# Altium schematic sheet RMII_Ethernet.SchDoc: Stabilizer
size 420 x 297 mm; Author: G.Kasprowicz; CompanyName: WUT ISE; DrawnBy: G.Kasprowicz; Organization: WUT ISE; Address1: PW ISE; Address2: Nowowiejska 15/19 00-665 Warsaw; Address3: gkasprow@gmail.com; DocumentNumber: 4; Revision: 3.4; SheetNumber: 4; SheetTotal: 11; ModifiedBy: -; CheckedDate: -; Title2: Ethernet; DivGrp: WUT ISE; Designer: G.Kasprowicz; ModifiedDate: -; ProjectName: Sensor Box
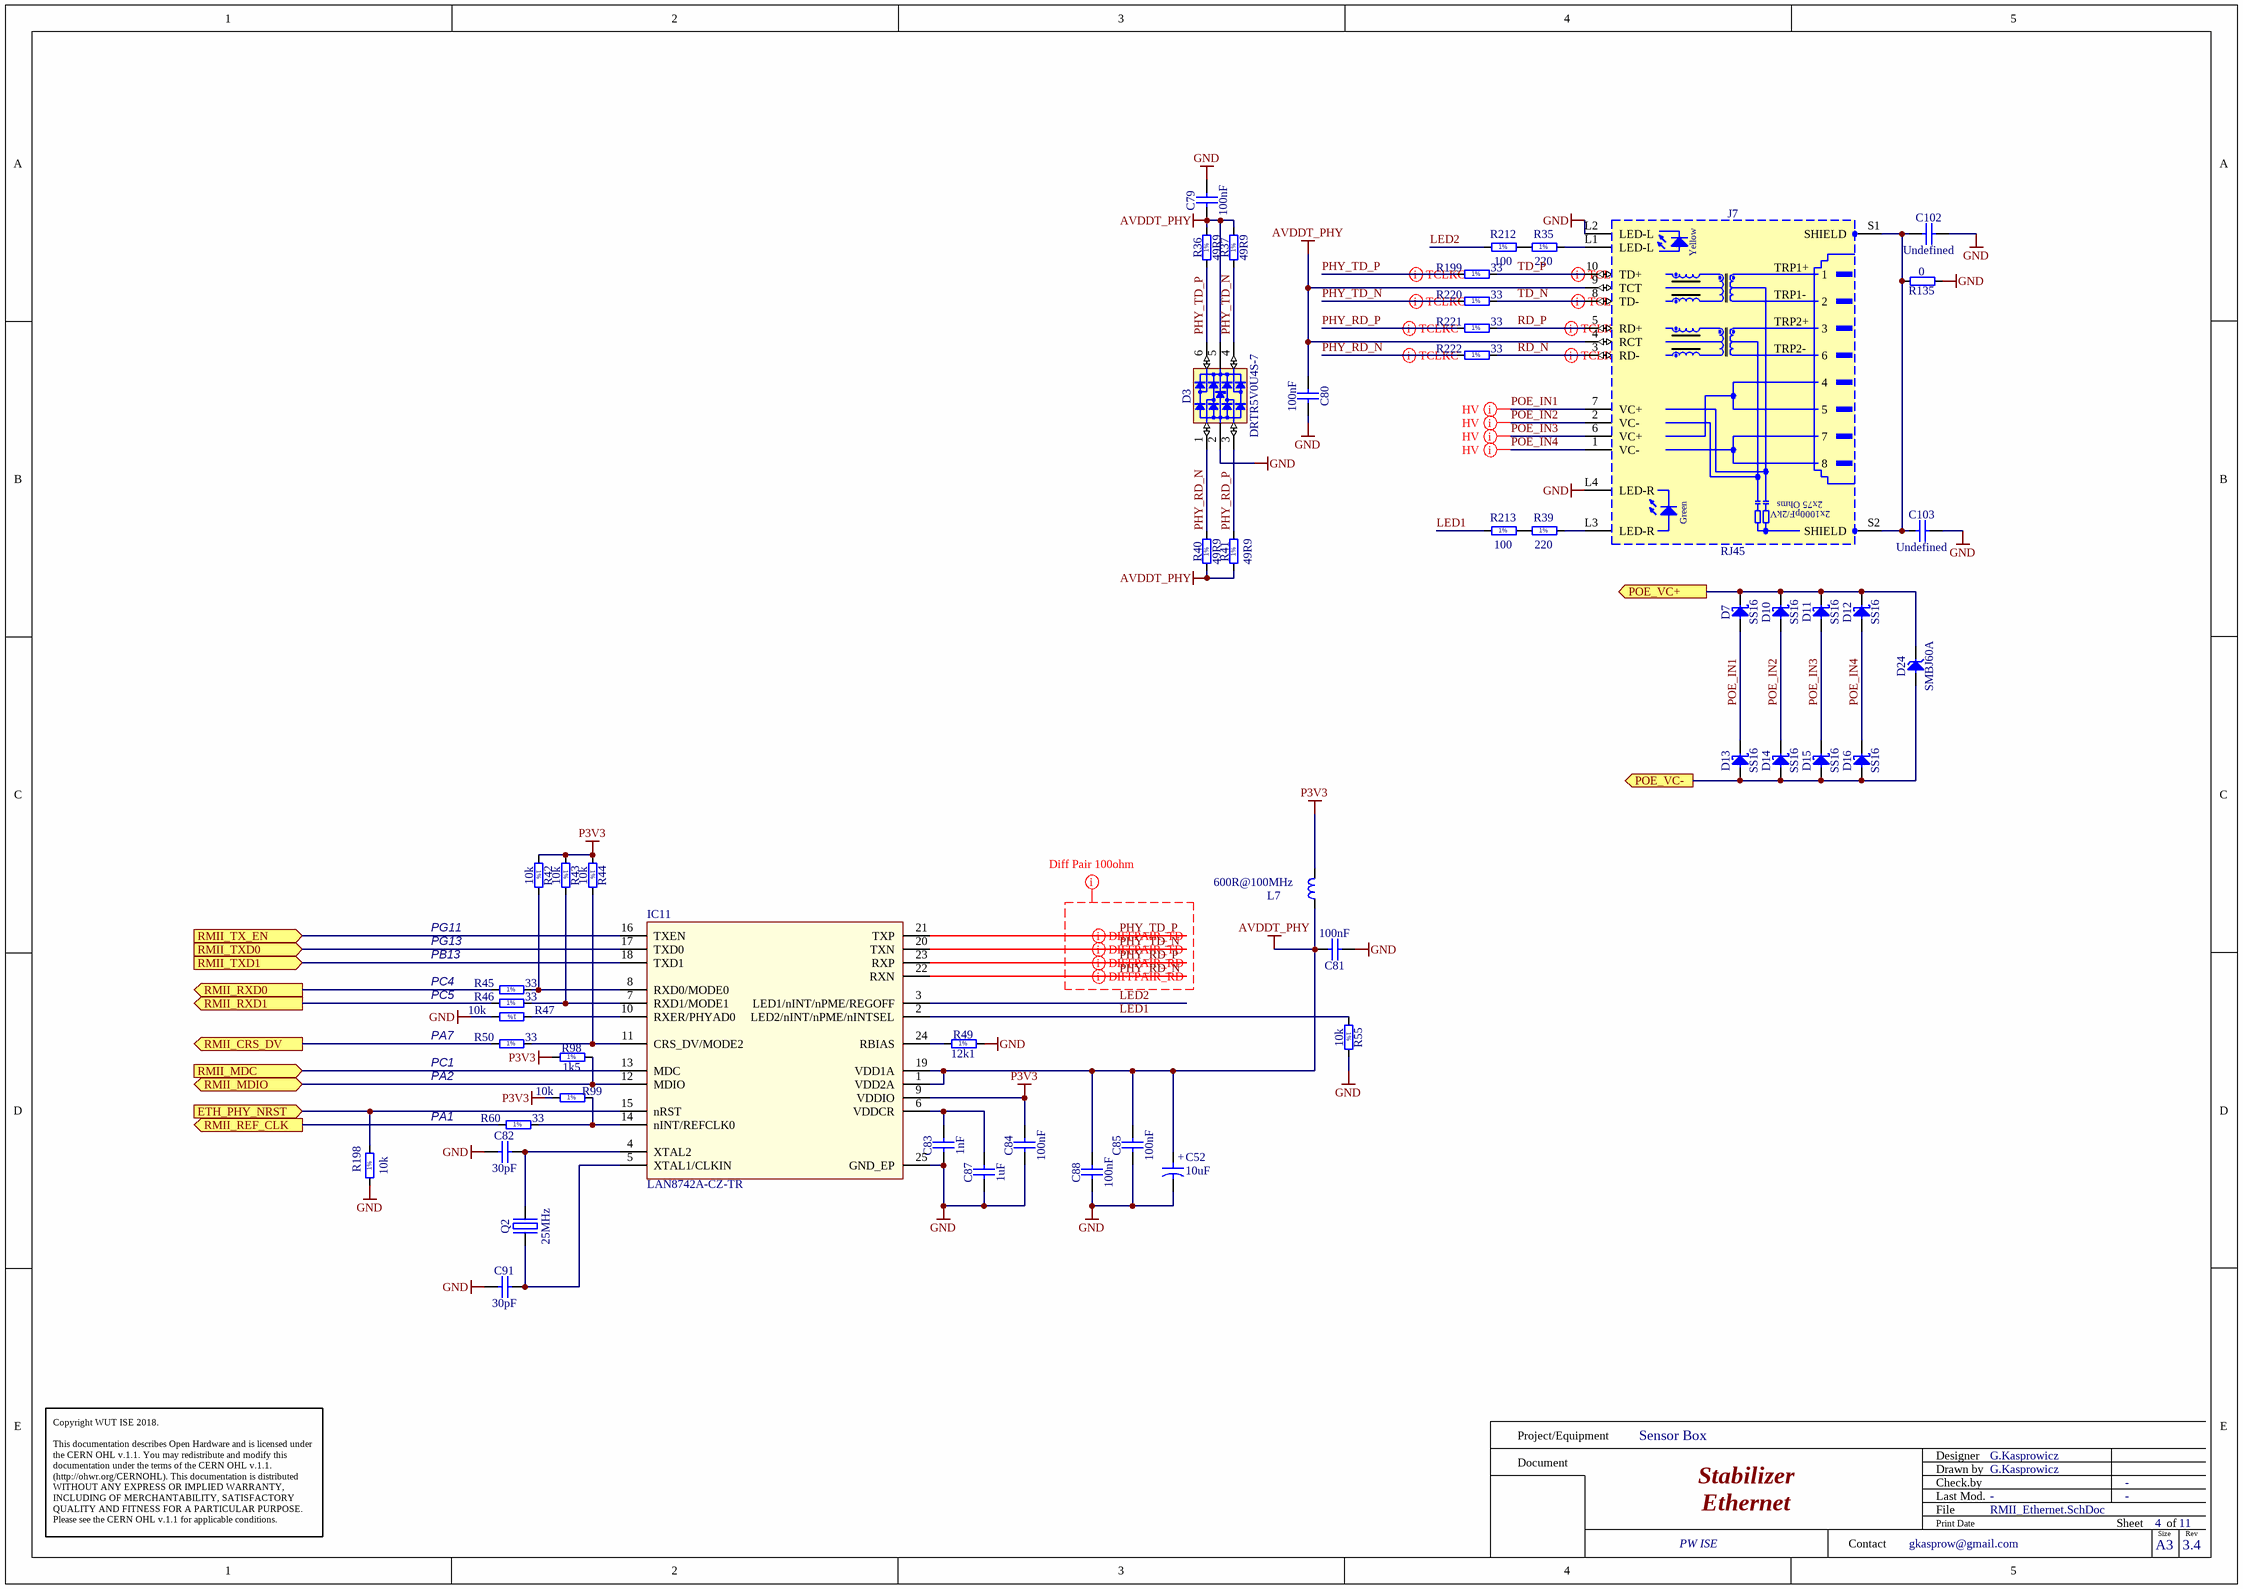
[diagram p0: RMII_Ethernet.SchDoc]

## Parts
C52  10uF  [CAPMP3216X180N]
C79  100nF  [CAPC1005X55N]
C80  100nF  [CAPC1005X55N]
C81  100nF  [CAPC1005X55N]
C82  30pF  [CAPC1005X55N]
C83  1nF  [CAPC1005X55N]
C84  100nF  [CAPC1005X55N]
C85  100nF  [CAPC1005X55N]
C87  1uF  [CAPC1608X87N]
C88  100nF  [CAPC1005X55N]
C91  30pF  [CAPC1005X55N]
C102  Undefined  [CAPC2012X135N]
C103  Undefined  [CAPC2012X135N]
D3  DRTR5V0U4S-7  [SOT65P210X110-6N]
D7  SS16  [DIOM5127X229N]
D10  SS16  [DIOM5127X229N]
D11  SS16  [DIOM5127X229N]
D12  SS16  [DIOM5127X229N]
D13  SS16  [DIOM5127X229N]
D14  SS16  [DIOM5127X229N]
D15  SS16  [DIOM5127X229N]
D16  SS16  [DIOM5127X229N]
D24  SMBJ60A  [DIOM5336X265N]
IC11  LAN8742A-CZ-TR  [QFN24_0R5_4X4]
J7  RJ45  [ABRACON_ARJM11C7-114-BA-EW2]
L7  600R@100MHz  [INDC1005X55N]
Q2  25MHz  [XTAL_ABRACON_ABLS]
R35  220  [RESC1608X55N]
R36  49R9  [RESC1005X40N]
R37  49R9  [RESC1005X40N]
R39  220  [RESC1608X55N]
R40  49R9  [RESC1005X40N]
R41  49R9  [RESC1005X40N]
R42  10k  [RESC1005X40N]
R43  10k  [RESC1005X40N]
R44  10k  [RESC1005X40N]
R45  33  [RESC1005X40N]
R46  33  [RESC1005X40N]
R47  10k  [RESC1005X40N]
R49  12k1  [RESC1005X40N]
R50  33  [RESC1005X40N]
R55  10k  [RESC1005X40N]
R60  33  [RESC1005X40N]
R98  1k5  [RESC1005X40N]
R99  10k  [RESC1005X40N]
R135  0  [RESC1608X55N]
R198  10k  [RESC1005X40N]
R199  33  [RESC1005X40N]
R212  100  [RESC1005X40N]
R213  100  [RESC1005X40N]
R220  33  [RESC1005X40N]
R221  33  [RESC1005X40N]
R222  33  [RESC1005X40N]

## Ports
ETH_PHY_NRST (in), POE_VC+ (out), POE_VC- (out), RMII_CRS_DV (out), RMII_MDC (in), RMII_MDIO (bidir), RMII_REF_CLK (out), RMII_RXD0 (out), RMII_RXD1 (out), RMII_TX_EN (in), RMII_TXD0 (in), RMII_TXD1 (in)

## Nets
AVDDT_PHY: C52.1 C79.1 C80.2 C81.2 C85.2 C88.2 D3.5(VBUS) IC11.1(VDD2A) IC11.19(VDD1A) J7.4(RCT) J7.9(TCT) L7.1 R36.2 R37.2 R40.1 R41.1
GND: C52.2 C79.2 C80.1 C81.1 C82.1 C83.1 C84.1 C85.1 C87.1 C88.1 C91.1 C102.2 C103.2 D3.2(GND) IC11.25(GND_EP) J7.L2(LED-L) J7.L4(LED-R) R47.2 R49.2 R55.2 R135.1 R198.1
P3V3: C84.2 IC11.9(VDDIO) L7.2 R42.1 R43.1 R44.1 R98.1 R99.1
ETH_PHY_NRST: IC11.15(nRST) R198.2 ; port ETH_PHY_NRST
LED1: IC11.2(LED2/nINT/nPME/nINTSEL) R55.1 R213.1
LED2: IC11.3(LED1/nINT/nPME/REGOFF) R212.1
PHY_RD_N: D3.1(I/O1) IC11.22(RXN) R40.2 R222.1
PHY_RD_P: D3.3(I/O2) IC11.23(RXP) R41.2 R221.1
PHY_TD_N: D3.4(I/O3) IC11.20(TXN) R37.1 R220.1
PHY_TD_P: D3.6(I/O4) IC11.21(TXP) R36.1 R199.1
POE_IN1: D7.2(A) D13.1(C) J7.7(VC+)
POE_IN2: D10.2(A) D14.1(C) J7.2(VC-)
POE_IN3: D11.2(A) D15.1(C) J7.6(VC+)
POE_IN4: D12.2(A) D16.1(C) J7.1(VC-)
POE_VC+: D7.1(C) D10.1(C) D11.1(C) D12.1(C) D24.1(C) ; port POE_VC+
POE_VC-: D13.2(A) D14.2(A) D15.2(A) D16.2(A) D24.2(A) ; port POE_VC-
RD_N: J7.3(RD-) R222.2
RD_P: J7.5(RD+) R221.2
RMII_CRS_DV: R50.1 ; port RMII_CRS_DV
RMII_MDC: IC11.13(MDC) ; port RMII_MDC
RMII_MDIO: IC11.12(MDIO) R98.2 ; port RMII_MDIO
RMII_REF_CLK: R60.1 ; port RMII_REF_CLK
RMII_RXD0: R45.1 ; port RMII_RXD0
RMII_RXD1: R46.1 ; port RMII_RXD1
RMII_TX_EN: IC11.16(TXEN) ; port RMII_TX_EN
RMII_TXD0: IC11.17(TXD0) ; port RMII_TXD0
RMII_TXD1: IC11.18(TXD1) ; port RMII_TXD1
TD_N: J7.8(TD-) R220.2
TD_P: J7.10(TD+) R199.2
NetC82_2: C82.2 IC11.4(XTAL2) Q2.2(OSC2)
NetC83_2: C83.2 C87.2 IC11.6(VDDCR)
NetC91_2: C91.2 IC11.5(XTAL1/CLKIN) Q2.1(OSC1)
NetC102_1: C102.1 C103.1 J7.S1(SHIELD) J7.S2(SHIELD) R135.2
NetIC11_7: IC11.7(RXD1/MODE1) R43.2 R46.2
NetIC11_8: IC11.8(RXD0/MODE0) R42.2 R45.2
NetIC11_10: IC11.10(RXER/PHYAD0) R47.1
NetIC11_11: IC11.11(CRS_DV/MODE2) R44.2 R50.2
NetIC11_14: IC11.14(nINT/REFCLK0) R60.2 R99.2
NetIC11_24: IC11.24(RBIAS) R49.1
NetJ7_L1: J7.L1(LED-L) R35.2
NetJ7_L3: J7.L3(LED-R) R39.2
NetR35_1: R35.1 R212.2
NetR39_1: R39.1 R213.2

## Layout directives
differential pair: PHY_RD_N, PHY_RD_P, PHY_TD_N, PHY_TD_P, RD_N, RD_P, TD_N, TD_P
net class HV: POE_IN1, POE_IN2, POE_IN3, POE_IN4
mark named Diff Pair 100ohm: PHY_RD_N, PHY_RD_P, PHY_TD_N, PHY_TD_P

## Notes on the sheet
- PG11
- PG13
- PB13
- PC4
- PC5
- PA7
- PC1
- PA2
- PA1
- Project/Equipment
- Document
- Designer
- Drawn by
- Check.by
- Copyright WUT ISE 2018.
  This documentation describes Open Hardware and is licensed under the CERN OHL v.1.1. You may redistribute and modify this documentation under the terms of the CERN OHL v.1.1. (http://ohwr.org/CERNOHL). This documentation is distributed WITHOUT ANY EXPRESS OR IMPLIED WARRANTY, INCLUDING OF MERCHANTABILITY, SATISFACTORY QUALITY AND FITNESS FOR A PARTICULAR PURPOSE. Please see the CERN OHL v.1.1 for applicable conditions.
- Contact
- File
- Last Mod.
- Print Date
- Sheet
- Size
- A3
- of
- Rev
- (in symbol CON_ETH_POE_ARJM11C7) Yellow; TRP1+; TRP1-; TRP2+; TRP2-; 2x75 Ohms; Green; 2x1000pF/2kV
- (in symbol CTE3216-18_10UF_16V_20%_AVX_TCJ) +
- (in symbol R0402_1K5_1%_0.0625W_100PPM) 1%
- (in symbol R0402_10K_1%_0.0625W_100PPM) 1%
- (in symbol R0402_12K1_1%_0.0625W_100PPM) 1%
- (in symbol R0402_33R_1%_0.0625W_100PPM) 1%
- (in symbol R0402_49R9_1%_0.0625W_100PPM) 1%
- (in symbol R0402_100R_1%_0.0625W_100PPM) 1%
- (in symbol R0603_220R_1%_0.1W_100PPM) 1%

## Library data of the parts
C52 = CTE3216-18_10UF_16V_20%_AVX_TCJ: Polarised capacitor; Part Description: ESR 0R200 Tantalum Solid Electrolytic Chip Capacitor with Conductive Polymer Electrode; Manufacturer: AVX; Manufacturer Part Number: TCJA106M016R0200; Voltage: 16V; Tolerance: ±20%; Part Number: CTE3216-18_10UF_16V_20%_AVX_TCJ; Component Kind: Standard; Component Type: Standard; Pin Count: 2; Value: 10uF; Status: Preferred; Case: A; Mounted: Yes; Socket: No; SMD: Yes; Sense: No; ComponentHeight: 1.8mm; HelpURL: \\cern.ch\dfs\Applications\Altium\Datasheets\CTE_AVX_TCJ.pdf; Author: CERN DEM JLC; CreateDate: 29.03.2012; LatestRevisionDate: 29.03.2012
C79-C81 C84 C85 C88 = CC0402_100NF_16V_10%_X5R: Non-polarised capacitor; Part Description: SMD Multilayer Chip Ceramic Capacitor; Manufacturer: GENERIC; Manufacturer1 Part Number: GRM155R61C104KA88D; Voltage: 16V; TC: X5R; Tolerance: ±10%; Part Number: CC0402_100NF_16V_10%_X5R; Component Kind: Standard; Component Type: Standard; Pin Count: 2; Value: 100nF; Status: None; Manufacturer Part Number: CC0402_100NF_16V_10%_X5R; Case: 0402; Mounted: Yes; Socket: No; SMD: Yes; Manufacturer1 Example: MURATA; Manufacturer1 ComponentHeight: 0.55mm; HelpURL: \\cern.ch\dfs\Applications\Altium\Datasheets\CC0402_X5R_MURATA_GRM.pdf; Author: CERN DEM JLC; Sense: No
  C79 C80: CreateDate: 10.12.2013; LatestRevisionDate: 10.12.2013
  C81 C84 C85 C88: CreateDate: 10/12/2013; LatestRevisionDate: 10/12/2013
C82 C91 = CC0402_30PF_50V_1%_C0G_MURATA_GJM1555C1H300FB01: Non-polarised capacitor; Part Description: High-Q SMD Chip Monolithic Ceramic Capacitor; Manufacturer: MURATA; Manufacturer Part Number: GJM1555C1H300FB01D; Voltage: 50V; TC: C0G/NP0; Tolerance: ±1%; Part Number: CC0402_30PF_50V_1%_C0G_MURATA_GJM1555C1H300FB01; Component Kind: Standard; Component Type: Standard; Pin Count: 2; Value: 30pF; Status: Not Recommended; Case: 0402; Mounted: Yes; Socket: No; SMD: Yes; Sense: No; ComponentHeight: 0.55mm; HelpURL: \\cern.ch\dfs\Applications\Altium\Datasheets\CC0402_MURATA_GJM1555C1H300FB01D.pdf; Author: CERN DEM BC; CreateDate: 20/11/2017; LatestRevisionDate: 20/11/2017
C83 = CC0402_1NF_50V_10%_X7R: Non-polarised capacitor; Part Description: SMD Multilayer Chip Ceramic Capacitor; Manufacturer: GENERIC; Manufacturer1 Part Number: 223858715623; Voltage: 50V; TC: X7R; Tolerance: ±10%; Part Number: CC0402_1NF_50V_10%_X7R; Component Kind: Standard; Component Type: Standard; Pin Count: 2; Value: 1nF; Status: Not Recommended; Manufacturer Part Number: CC0402_1NF_50V_10%_X7R; Case: 0402; Mounted: Yes; Socket: No; SMD: Yes; Sense: No; Manufacturer1 Example: PHYCOMP; Manufacturer1 ComponentHeight: 0.55mm; HelpURL: \\cern.ch\dfs\Applications\Altium\Datasheets\CC0402_X7R_PHYCOMP.pdf; Author: CERN DEM JLC; CreateDate: 03/12/2007; LatestRevisionDate: 03/12/2007
C87 = CC0603_1UF_16V_10%_X7R: Non-polarised capacitor; Part Description: SMD Multilayer Chip Ceramic Capacitor; Manufacturer: GENERIC; Manufacturer1 Part Number: 223878615663; Voltage: 16V; TC: X7R; Tolerance: ±10%; Part Number: CC0603_1UF_16V_10%_X7R; Component Kind: Standard; Component Type: Standard; Pin Count: 2; Value: 1uF; Status: None; Manufacturer Part Number: CC0603_1uF_16V_10%_X7R; Case: 0603; Mounted: Yes; Socket: No; SMD: Yes; Sense: No; Manufacturer1 Example: YAGEO PHYCOMP; Manufacturer1 ComponentHeight: 0.9mm; HelpURL: \\cern.ch\dfs\Applications\Altium\Datasheets\CC0603_X7R_PHYCOMP.pdf; Author: CERN DEM JLC; CreateDate: 03/12/2007; LatestRevisionDate: 17/04/2015
C102 C103 = CC0805_NO-VALUE: Non-polarised capacitor; Part Description: Reserved Footprint For 0805(2012) Chip Ceramic Capacitor; Mounted: No; Part Number: CC0805_NO-VALUE; Component Kind: Standard; Component Type: Standard; Pin Count: 2; Value: Undefined; Status: None; Manufacturer: Undefined; Manufacturer Part Number: CC0805_NO-VALUE; Case: 0805; Socket: No; SMD: Yes; Sense: No; Manufacturer1 ComponentHeight: 1.35mm; HelpURL: Undefined; Author: CERN DEM JLC; CreateDate: 10.12.2008; LatestRevisionDate: 11.09.2013
D3 = D_TVS_DRTR5V0U4S-7: Integrated Quad Ultra-Low Capacitance ESD Protection; Part Description: Integrated Quad Ultra-Low Capacitance ESD (±8kV) Protection; Manufacturer: DIODES; PressFit: No; Bonding: No; Status Comment: Active; Part Number: DRTR5V0U4S-7; Component Kind: Standard; Component Type: Standard; Device: DRTR5V0U4S-7; PackageDescription: SOT363, SC70-6, 0.65mm Pitch; 6 Pin, 1.25mm W X 2.00mm L X 1.10mm H body, IPC Medium Density; Status: Active; Manufacturer Part Number: DRTR5V0U4S-7; Pin Count: 6; Case: SOT363; Mounted: Yes; Socket: No; SMD: Yes; Sense: No; ComponentHeight: 1.1mm; HelpURL: \\cern.ch\dfs\Applications\Altium\Datasheets\PRTR5V0U4Y.pdf; Author: GK; CreateDate: 24.01.2017; LatestRevisionDate: 14.09.2020
D7 D10-D16 = SS16: Schottky Diode; Part Description: Surface Mount Schottky Barrier Rectifier; Manufacturer: VISHAY GENERAL SEMICONDUCTOR; Voltage: 60V; Power: 1A; PressFit: No; Bonding: No; Part Number: SS16; Component Kind: Standard; Component Type: Standard; Device: SS16; PackageDescription: DO-214-AC Molded Diode, Body 5.1x2.7mm, IPC Medium Density; Manufacturer Part Number: SS16; Pin Count: 2; Case: DO-214AC; Mounted: Yes; Socket: No; SMD: Yes; Sense: No; ComponentHeight: 2.29mm; HelpURL: \\cern.ch\dfs\Applications\Altium\Datasheets\SS16.pdf; Author: CERN DEM JLC; CreateDate: 15.07.2008; LatestRevisionDate: 23.08.2010
D24 = SMBJ60A: Zener Diode; Part Description: Uni-Directional Transient Voltage Suppressor Diode; Manufacturer: FAIRCHILD SEMICONDUCTOR; Voltage: 60V; Power: 600W; PressFit: No; Bonding: No; Part Number: SMBJ60A; Component Kind: Standard; Component Type: Standard; Device: SMBJ60A; PackageDescription: DO-214-AA/SMB Diode, Molded Body; 5.34mm L X 3.625mm W X 2.65mm H, IPC Medium Density; Manufacturer Part Number: SMBJ60A; Pin Count: 2; Case: DO-214AA; Mounted: Yes; Socket: No; SMD: Yes; Sense: No; ComponentHeight: 2.65mm; HelpURL: \\cern.ch\dfs\Applications\Altium\Datasheets\SMBJ.pdf; Author: CERN DEM JLC; CreateDate: 30.06.2008; LatestRevisionDate: 19.12.2011
IC11 = IFC_LAN8742A: LAN8742A-CZ-TR - Small Footprint RMII 10/100 Ethernet, Transceiver with HP Auto-MDIX and flexPWR Technology SQFN-24; Manuf_1: MICROCHIP; Order: LAN8742A-CZ-TR; Manuf_Part_1: LAN8742A-CZ-TR; Distrib: MICROCHIP
J7 = CON_ETH_POE_ARJM11C7: MagJack 10/100BaseT, PoE+, 1X1, OG/Y, -40 to 85*C, Tab Up, RoHS; Part Number: ARJM11C7-114-BA-EW2; Part Description: 1 Port, Orange Green/Yellow LEDs, RJ45 10/100BaseT, PoE, Ethernet MagJack® Connector Module; Manufacturer: Abracon; PressFit: No; Component Kind: Standard; Component Type: Standard; Pin Count: 18; Family: RJ45; Mounted: Yes; Socket: No; SMD: No; Sense: No; Status: None; Manufacturer Part Number: ARJM11C7-114-BA-EW2; ComponentHeight: 13.61mm; HelpURL: \\cern.ch\dfs\Applications\Altium\Datasheets\BELFUSE_0826-1X1T-GJ-F.pdf; Author: GK; CreateDate: 05.11.2012; LatestRevisionDate: 05.11.2012
L7 = IND0402_MURATA_BLM15HD601SN1: Inductor; Part Description: SMD EMIFIL Suppression Chip Ferrite Bead; Manufacturer: MURATA; Manufacturer Part Number: BLM15HD601SN1D; Power: 300mA; Resistance: 0.85R; Tolerance: ±25%; Part Number: IND0402_MURATA_BLM15HD601SN1; Component Kind: Standard; Component Type: Standard; Pin Count: 2; Value: 600R@100MHz; Status: None; Case: 0402; Mounted: Yes; Socket: No; SMD: Yes; Sense: No; ComponentHeight: 0.55mm; HelpURL: \\cern.ch\dfs\Applications\Altium\Datasheets\IND0402_MURATA_BLM15H.pdf; Author: CERN DEM JLC; CreateDate: 28/02/2012; LatestRevisionDate: 28/02/2012
Q2 = XTAL_25MHZ_ABRACON_ABLS-25.000MHZ-B2F-T: Quartz Crystal; Part Description: Tolerance: ± 20ppm, Stability: ± 50ppm, -20°C to +70°C, 18pF, 40 Ohms ESR, Low Profile Surface Mount Microprocessor Crystal, ABLS Series; PressFit: No; Bonding: No; Part Number: XTAL_25MHZ_ABRACON_ABLS-25.000MHZ-B2F-T; Component Kind: Standard; Component Type: Standard; PackageDescription: SMD Crystal, Body 11.40mm L X 4.70mm W X 4.20mm H, HC/49US (AT49) ALBS Series; Value: 25MHz; Manufacturer: ABRACON; Manufacturer Part Number: ABLS-25.000MHZ-B2F-T; Pin Count: 2; Mounted: Yes; Socket: No; SMD: Yes; Sense: No; ComponentHeight: 4.2mm; HelpURL: \\cern.ch\dfs\Applications\Altium\Datasheets\XTAL_ABRACON_ABLS.pdf; Author: CERN DEM JLC; CreateDate: 03/06/2010; LatestRevisionDate: 15/02/2018
R35 R39 = R0603_220R_1%_0.1W_100PPM: Resistor - 1%; Part Description: General Purpose Thick Film Chip Resistor; Manufacturer: GENERIC; Manufacturer1 Part Number: NRC06F2200TRF; Power: 0.1W; TC: ±100ppm/°C; PressFit: No; Part Number: R0603_220R_1%_0.1W_100PPM; Component Kind: Standard; Component Type: Standard; Pin Count: 2; Value: 220; Status: Preferred; Tolerance: ±1%; Manufacturer Part Number: R0603_220R_1%_0.1W_100PPM; Case: 0603; Mounted: Yes; Sense: No; Socket: No; SMD: Yes; Manufacturer1 Example: NIC COMPONENT; Manufacturer1 ComponentHeight: 0.55mm; HelpURL: \\cern.ch\dfs\Applications\Altium\Datasheets\R0603_NIC_NRC.pdf; Author: CERN DEM JLC; CreateDate: 03.12.2007; LatestRevisionDate: 13.03.2008
R36 R37 R40 R41 = R0402_49R9_1%_0.0625W_100PPM: Resistor - 1%; Part Description: General Purpose Thick Film Chip Resistor; Manufacturer: GENERIC; Manufacturer1 Part Number: 232270674999L or RC0402FR-0749R9L; TC: ±100ppm/°C; Table: Resistors SMD; Part Number: R0402_49R9_1%_0.0625W_100PPM; Component Kind: Standard; Component Type: Standard; Pin Count: 2; Value: 49R9; Status: Not recommended; Power: 0.0625W; Tolerance: ±1%; Manufacturer Part Number: R0402_49R9_1%_0.0625W_100PPM; Case: 0402; Mounted: Yes; Socket: No; SMD: Yes; Manufacturer1 Example: YAGEO PHYCOMP; Manufacturer1 ComponentHeight: 0.4mm; HelpURL: \\cern.ch\dfs\Applications\Altium\Datasheets\R0402_Phycomp_RC0402.pdf; Author: CERN DEM JLC; CreateDate: 2012-10-24; LatestRevisionDate: 2012-10-24
R42-R44 R47 R55 R99 R198 = R0402_10K_1%_0.0625W_100PPM: Resistor - 1%; Part Description: General Purpose Thick Film Chip Resistor; Manufacturer: GENERIC; Manufacturer1 Part Number: 232270671003L; TC: ±100ppm/°C; PressFit: No; Value: 10k; Part Number: R0402_10K_1%_0.0625W_100PPM; Component Kind: Standard; Component Type: Standard; Pin Count: 2; Status: Not Recommended; Power: 0.0625W; Tolerance: ±1%; Manufacturer Part Number: R0402_10K_1%_0.0625W_100PPM; Case: 0402; Mounted: Yes; Sense: No; Socket: No; SMD: Yes; Manufacturer1 Example: YAGEO PHYCOMP; Manufacturer1 ComponentHeight: 0.4mm; HelpURL: \\cern.ch\dfs\Applications\Altium\Datasheets\R0402_Phycomp_RC0402.pdf; Author: CERN DEM JLC; CreateDate: 03/12/2007; LatestRevisionDate: 17/10/2012
R45 R46 R50 R60 R199 R220-R222 = R0402_33R_1%_0.0625W_100PPM: Resistor - 1%; Part Description: General Purpose Thick Film Chip Resistor; Manufacturer: GENERIC; Manufacturer1 Part Number: 232270673309L; TC: ±100ppm/°C; PressFit: No; Part Number: R0402_33R_1%_0.0625W_100PPM; Component Kind: Standard; Component Type: Standard; Pin Count: 2; Value: 33; Status: Not Recommended; Power: 0.0625W; Tolerance: ±1%; Manufacturer Part Number: R0402_33R_1%_0.0625W_100PPM; Case: 0402; Mounted: Yes; Sense: No; Socket: No; SMD: Yes; Manufacturer1 Example: YAGEO PHYCOMP; Manufacturer1 ComponentHeight: 0.4mm; HelpURL: \\cern.ch\dfs\Applications\Altium\Datasheets\R0402_Phycomp_RC0402.pdf; Author: CERN DEM JLC; CreateDate: 03/12/2007; LatestRevisionDate: 17/10/2012
R49 = R0402_12K1_1%_0.0625W_100PPM: Resistor - 1%; Part Description: General Purpose Thick Film Chip Resistor; Manufacturer: GENERIC; Manufacturer1 Part Number: 232270671213L or RC0402FR-0712K1L; TC: ±100ppm/°C; PressFit: No; Part Number: R0402_12K1_1%_0.0625W_100PPM; Component Kind: Standard; Component Type: Standard; Pin Count: 2; Value: 12k1; Status: Not Recommended; Power: 0.0625W; Tolerance: ±1%; Manufacturer Part Number: R0402_12K1_1%_0.0625W_100PPM; Case: 0402; Mounted: Yes; Sense: No; Socket: No; SMD: Yes; Manufacturer1 Example: YAGEO PHYCOMP; Manufacturer1 ComponentHeight: 0.4mm; HelpURL: \\cern.ch\dfs\Applications\Altium\Datasheets\R0402_Phycomp_RC0402.pdf; Author: CERN DEM JLC; CreateDate: 24/10/2012; LatestRevisionDate: 24/10/2012
R98 = R0402_1K5_1%_0.0625W_100PPM: Resistor - 1%; Part Description: General Purpose Thick Film Chip Resistor; Manufacturer: GENERIC; Manufacturer1 Part Number: 232270671502L; TC: ±100ppm/°C; PressFit: No; Part Number: R0402_1K5_1%_0.0625W_100PPM; Component Kind: Standard; Component Type: Standard; Pin Count: 2; Value: 1k5; Status: Not Recommended; Power: 0.0625W; Tolerance: ±1%; Manufacturer Part Number: R0402_1K5_1%_0.0625W_100PPM; Case: 0402; Mounted: Yes; Sense: No; Socket: No; SMD: Yes; Manufacturer1 Example: YAGEO PHYCOMP; Manufacturer1 ComponentHeight: 0.4mm; HelpURL: \\cern.ch\dfs\Applications\Altium\Datasheets\R0402_Phycomp_RC0402.pdf; Author: CERN DEM JLC; CreateDate: 03/12/2007; LatestRevisionDate: 17/10/2012
R135 = R0603_0R_JUMPER: Resistor; Part Description: 1A (0.05R Max DC Resistance) Zero Ohm Jumper; Manufacturer: GENERIC; Manufacturer1 Part Number: NRC06Z0; PressFit: No; Part Number: R0603_0R_JUMPER; Component Kind: Standard; Component Type: Standard; Pin Count: 2; Value: 0; Status: Preferred; Manufacturer Part Number: R0603_0R_JUMPER; Case: 0603; Mounted: Yes; Sense: No; Socket: No; SMD: Yes; Manufacturer1 Example: NIC COMPONENT; Manufacturer1 ComponentHeight: 0.55mm; HelpURL: \\cern.ch\dfs\Applications\Altium\Datasheets\R0603_NIC_NRC.pdf; Author: CERN DEM JLC; CreateDate: 03.12.2007; LatestRevisionDate: 13.03.2008
R212 R213 = R0402_100R_1%_0.0625W_100PPM: Resistor - 1%; Part Description: General Purpose Thick Film Chip Resistor; Manufacturer: GENERIC; Manufacturer1 Part Number: 232270671001L; TC: ±100ppm/°C; PressFit: No; Part Number: R0402_100R_1%_0.0625W_100PPM; Component Kind: Standard; Component Type: Standard; Pin Count: 2; Value: 100; Status: Not Recommended; Power: 0.0625W; Tolerance: ±1%; Manufacturer Part Number: R0402_100R_1%_0.0625W_100PPM; Case: 0402; Mounted: Yes; Sense: No; Socket: No; SMD: Yes; Manufacturer1 Example: YAGEO PHYCOMP; Manufacturer1 ComponentHeight: 0.4mm; HelpURL: \\cern.ch\dfs\Applications\Altium\Datasheets\R0402_Phycomp_RC0402.pdf; Author: CERN DEM JLC; CreateDate: 03.12.2007; LatestRevisionDate: 17.10.2012